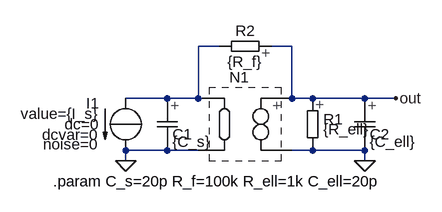
[diagram p0: schematic transimpedanceIdeal.asc]
transimpedanceIdeal.asc, the LTspice schematic file:
Version 4
SHEET 1 880 680
WIRE 176 32 144 32
WIRE 288 32 256 32
WIRE 96 112 32 112
WIRE 144 112 144 32
WIRE 144 112 96 112
WIRE 288 112 288 32
WIRE 320 112 288 112
WIRE 400 112 320 112
WIRE 448 112 400 112
WIRE 96 192 32 192
WIRE 144 192 96 192
WIRE 320 192 288 192
WIRE 400 192 320 192
WIRE 32 208 32 192
WIRE 400 208 400 192
FLAG 32 208 0
FLAG 448 112 out
FLAG 400 208 0
SYMBOL SLC 96 112 R0
SYMATTR InstName C1
SYMATTR Value {C_s}
SYMBOL SLI 32 112 M0
SYMATTR InstName I1
SYMATTR Value value={I_s}
SYMBOL SLR 320 112 R0
SYMATTR InstName R1
SYMATTR Value {R_ell}
SYMBOL SLC 400 112 R0
SYMATTR InstName C2
SYMATTR Value {C_ell}
SYMBOL SLN 224 96 R0
SYMATTR InstName N1
SYMBOL SLR 256 32 R90
WINDOW 0 -8 40 VBottom 2
WINDOW 3 8 40 VTop 2
SYMATTR InstName R2
SYMATTR Value {R_f}
TEXT -80 240 Left 2 !.param C_s=20p R_f=100k R_ell=1k C_ell=20p

The netlist it stands for:
* transimpedanceIdeal.asc
C1 N001 0 {C_s}
I1 N001 0 I value={I_s} dc=0 dcvar=0 noise=0
R1 out 0 {R_ell}
C2 out 0 {C_ell}
N1 out 0 N001 0
R2 out N001 {R_f}
.param C_s=20p R_f=100k R_ell=1k C_ell=20p
.backanno
.end